# EAGLE design TSOC_Teensy3X (EAGLE 6.6.0)
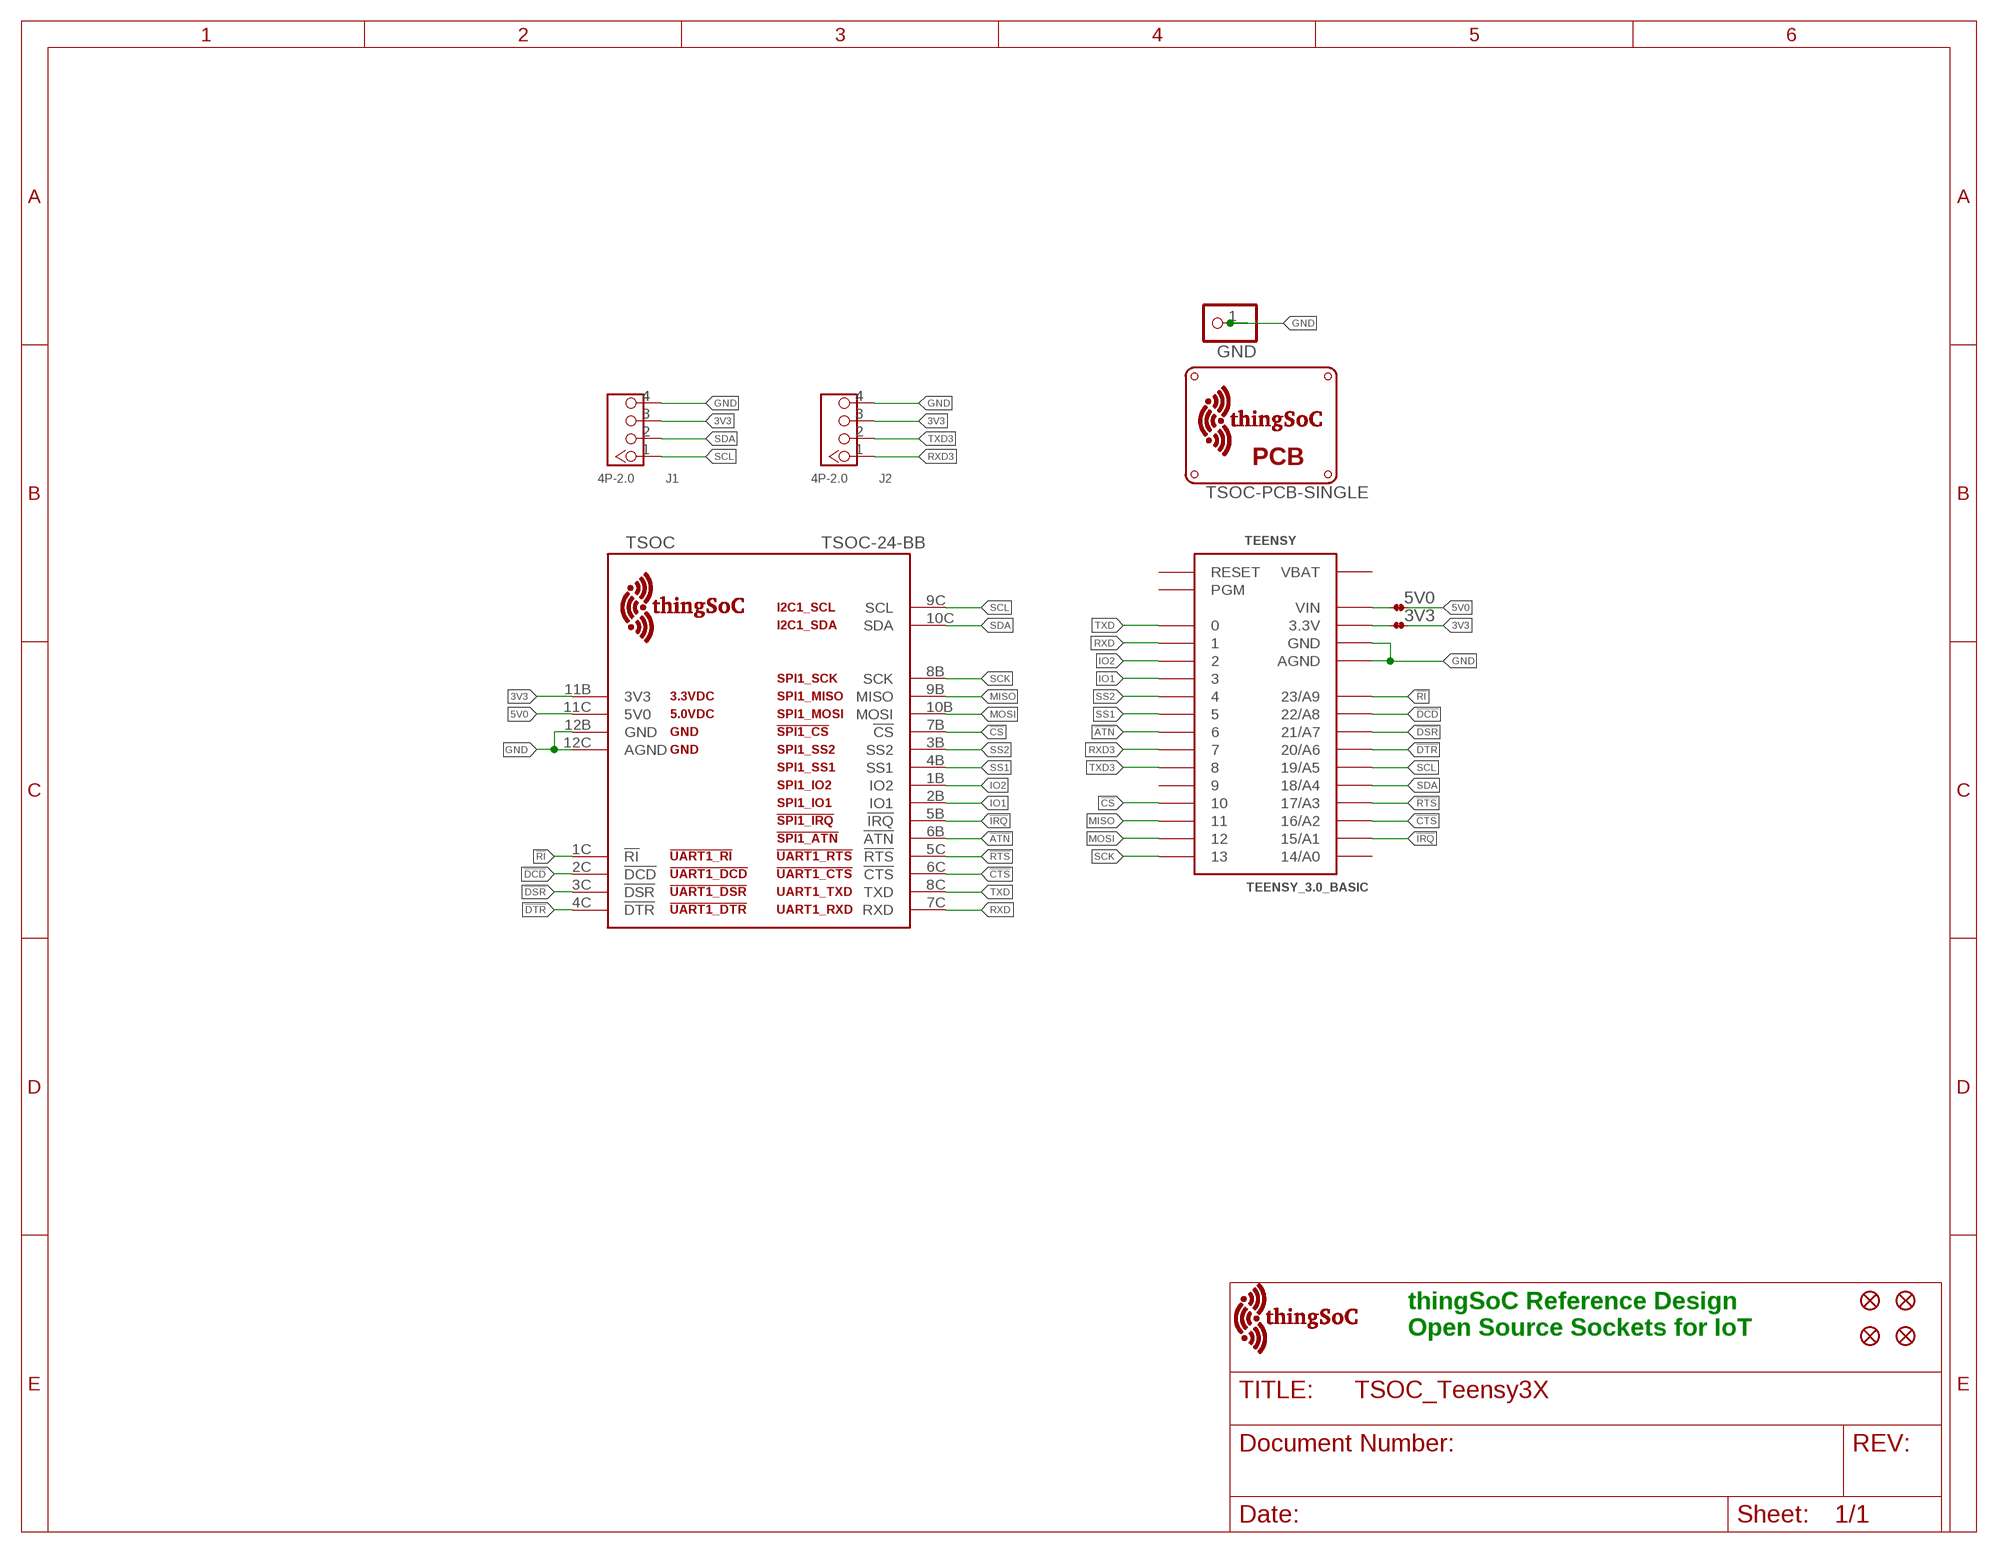
[diagram p0: schematic, sheet 1]

## Parts
3V3  JMP-2-NC  [JMP-2-NC]
5V0  JMP-2-NC  [JMP-2-NC]
FID1  FIDUCIALUFIDUCIAL  [MICRO-FIDUCIAL]
FID2  FIDUCIALUFIDUCIAL  [MICRO-FIDUCIAL]
FID3  FIDUCIALUFIDUCIAL  [MICRO-FIDUCIAL]
FID4  FIDUCIALUFIDUCIAL  [MICRO-FIDUCIAL]
GND  WPAD-1-PTH  [WPAD-1-PTH-2.54]
J1  4P-2.0  GROVE-CONNECTOR-DIP(4P-2.0)  [HW4-2.0]
J2  4P-2.0  GROVE-CONNECTOR-DIP(4P-2.0)  [HW4-2.0]
TEENSY  TEENSY_3.0_BASIC  [TEENSY_3.0_BASIC]
TSOC  TSOC-24-BB  [TSOC-BB-S24]
U$2  TSOC-PCB-SINGLE  [TSOC-BB-BRD-DIM]
U$5  TSOC-LOGO-LRG  [TSOC-LOGO-LRG]

## Nets
3V3: 3V3.2 J1.3 J2.3 TSOC.11B(3V3)
3V3I: 3V3.1 TEENSY.3.3V TEENSY.3.3V1(3.3V)
5V0: 5V0.2 TSOC.11C(5V0)
!ATN: TEENSY.6 TSOC.6B(!ATN)
!CS: TEENSY.10 TSOC.7B(!CS)
!CTS: TEENSY.16/A2 TSOC.6C(!CTS)
!DCD: TEENSY.22/A8 TSOC.2C(!DCD)
!DSR: TEENSY.21/A7 TSOC.3C(!DSR)
!DTR: TEENSY.20/A6 TSOC.4C(!DTR)
!IRQ: TEENSY.15/A1 TSOC.5B(!IRQ)
!RI: TEENSY.23/A9 TSOC.1C(!RI)
!RTS: TEENSY.17/A3 TSOC.5C(!RTS)
GND: GND.1 J1.4 J2.4 TEENSY.AGND TEENSY.GND TEENSY.GND1(GND) TSOC.12B(GND) TSOC.12C(AGND)
IO1: TEENSY.3 TSOC.2B(IO1)
IO2: TEENSY.2 TSOC.1B(IO2)
MISO: TEENSY.11 TSOC.9B(MISO)
MOSI: TEENSY.12 TSOC.10B(MOSI)
RXD: TEENSY.1 TSOC.7C(RXD)
RXD3: J2.1 TEENSY.7
SCK: TEENSY.13 TSOC.8B(SCK)
SCL: J1.1 TEENSY.19/A5 TSOC.9C(SCL)
SDA: J1.2 TEENSY.18/A4 TSOC.10C(SDA)
SS1: TEENSY.5 TSOC.4B(SS1)
SS2: TEENSY.4 TSOC.3B(SS2)
TXD: TEENSY.0 TSOC.8C(TXD)
TXD3: J2.2 TEENSY.8
VIN: 5V0.1 TEENSY.VIN
Unconnected: TEENSY.9 TEENSY.14/A0 TEENSY.PGM TEENSY.RESET

## Notes on the sheet
- thingSoC Reference Design
  Open Source Sockets for IoT

## Power pins joined to a net without a drawn wire
VBAT: TEENSY.VBAT

## Library data of the parts
3V3 5V0 = PatternAgents-ProtoPads:JMP-2-NC: Two Terminal Jumper - Normally Closed Positions 1 and 2 are normally connected. PatternAgents ProtoPads Library Schematic and PCB layout libraries for design patterns by PatternAgents. For the CADSoft Eagle CAD program : http://www.cadsoftusa.com/download-eagle/ Source LBR : http://www.patternagents.com Github : https://github.com/PatternAgents License : http://creativecommons.org/licenses/by-sa/4.0/ (Creative Commons 4.0) THIS SOFTWARE IS PROVIDED BY THE CONTRIBUTORS "AS IS" AND WITHOUT ANY EXPRESS OR IMPLIED WARRANTIES, INCLUDING, BUT NOT LIMITED TO, THE IMPLIED WARRANTIES OF MERCHANTABILITY AND FITNESS FOR A PARTICULAR PURPOSE ARE DISCLAIMED. IN NO EVENT SHALL THE COPYRIGHT OWNER OR CONTRIBUTORS BE LIABLE FOR ANY DIRECT, INDIRECT, INCIDENTAL, SPECIAL, EXEMPLARY, OR CONSEQUENTIAL DAMAGES (INCLUDING, BUT NOT LIMITED TO, PROCUREMENT OF SUBSTITUTE GOODS OR SERVICES; LOSS OF USE, DATA, OR PROFITS; OR BUSINESS INTERRUPTION) HOWEVER CAUSED AND ON ANY THEORY OF LIABILITY, WHETHER IN CONTRACT, STRICT LIABILITY, OR TORT (INCLUDING NEGLIGENCE OR OTHERWISE) ARISING IN ANY WAY OUT OF THE USE OF THIS SOFTWARE, EVEN IF ADVISED OF THE POSSIBILITY OF SUCH DAMAGE.; BOM: EXCLUDE
FID1-FID4 = TSOC-ESP8266-BASE:FIDUCIAL: Fiducial Alignment Points Various fiducial points for machine vision alignment.
GND = PatternAgents-ProtoPads:WPAD-1: Wire Pad - Single Good for scope lead clips, test jumpers, probe points, etc. PatternAgents ProtoPads Library Schematic and PCB layout libraries for design patterns by PatternAgents. For the CADSoft Eagle CAD program : http://www.cadsoftusa.com/download-eagle/ Source LBR : http://www.patternagents.com Github : https://github.com/PatternAgents License : http://creativecommons.org/licenses/by-sa/4.0/ (Creative Commons 4.0) THIS SOFTWARE IS PROVIDED BY THE CONTRIBUTORS "AS IS" AND WITHOUT ANY EXPRESS OR IMPLIED WARRANTIES, INCLUDING, BUT NOT LIMITED TO, THE IMPLIED WARRANTIES OF MERCHANTABILITY AND FITNESS FOR A PARTICULAR PURPOSE ARE DISCLAIMED. IN NO EVENT SHALL THE COPYRIGHT OWNER OR CONTRIBUTORS BE LIABLE FOR ANY DIRECT, INDIRECT, INCIDENTAL, SPECIAL, EXEMPLARY, OR CONSEQUENTIAL DAMAGES (INCLUDING, BUT NOT LIMITED TO, PROCUREMENT OF SUBSTITUTE GOODS OR SERVICES; LOSS OF USE, DATA, OR PROFITS; OR BUSINESS INTERRUPTION) HOWEVER CAUSED AND ON ANY THEORY OF LIABILITY, WHETHER IN CONTRACT, STRICT LIABILITY, OR TORT (INCLUDING NEGLIGENCE OR OTHERWISE) ARISING IN ANY WAY OUT OF THE USE OF THIS SOFTWARE, EVEN IF ADVISED OF THE POSSIBILITY OF SUCH DAMAGE.; BOM: EXCLUDE
J1 J2 = Seeed-Connector -2016:GROVE-CONNECTOR-DIP(4P-2.0): 320110033
TEENSY = Teensy3.0:TEENSY_3.0_BASIC: Basic Teensy 3.0 with none of the 'inner' pins enabled. See '+4', 'AllAnalogPins", and 'AllPins' packages for additional pin holes, as needed.
TSOC = thingSoC:TSOC-24: thingSoC Twenty-Four(24) Pin Socket Source LBR : http://www.thingsoc.com Github : https://github.com/thingsoc License : http://creativecommons.org/licenses/by-sa/4.0/ (Creative Commons 4.0) THIS SOFTWARE IS PROVIDED BY THE CONTRIBUTORS "AS IS" AND WITHOUT ANY EXPRESS OR IMPLIED WARRANTIES, INCLUDING, BUT NOT LIMITED TO, THE IMPLIED WARRANTIES OF MERCHANTABILITY AND FITNESS FOR A PARTICULAR PURPOSE ARE DISCLAIMED. IN NO EVENT SHALL THE COPYRIGHT OWNER OR CONTRIBUTORS BE LIABLE FOR ANY DIRECT, INDIRECT, INCIDENTAL, SPECIAL, EXEMPLARY, OR CONSEQUENTIAL DAMAGES (INCLUDING, BUT NOT LIMITED TO, PROCUREMENT OF SUBSTITUTE GOODS OR SERVICES; LOSS OF USE, DATA, OR PROFITS; OR BUSINESS INTERRUPTION) HOWEVER CAUSED AND ON ANY THEORY OF LIABILITY, WHETHER IN CONTRACT, STRICT LIABILITY, OR TORT (INCLUDING NEGLIGENCE OR OTHERWISE) ARISING IN ANY WAY OUT OF THE USE OF THIS SOFTWARE, EVEN IF ADVISED OF THE POSSIBILITY OF SUCH DAMAGE.
U$2 = thingSoC:TSOC-PCB: thingSoC PCB Outlines Boards Outlines for Standard Sizes (in the DImension Layer) (Registration marks in the tDocu layer - make sure to turn on tDocu/bDocu) Source LBR : http://www.thingsoc.com Github : https://github.com/thingsoc License : http://creativecommons.org/licenses/by-sa/4.0/ (Creative Commons 4.0) THIS SOFTWARE IS PROVIDED BY THE CONTRIBUTORS "AS IS" AND WITHOUT ANY EXPRESS OR IMPLIED WARRANTIES, INCLUDING, BUT NOT LIMITED TO, THE IMPLIED WARRANTIES OF MERCHANTABILITY AND FITNESS FOR A PARTICULAR PURPOSE ARE DISCLAIMED. IN NO EVENT SHALL THE COPYRIGHT OWNER OR CONTRIBUTORS BE LIABLE FOR ANY DIRECT, INDIRECT, INCIDENTAL, SPECIAL, EXEMPLARY, OR CONSEQUENTIAL DAMAGES (INCLUDING, BUT NOT LIMITED TO, PROCUREMENT OF SUBSTITUTE GOODS OR SERVICES; LOSS OF USE, DATA, OR PROFITS; OR BUSINESS INTERRUPTION) HOWEVER CAUSED AND ON ANY THEORY OF LIABILITY, WHETHER IN CONTRACT, STRICT LIABILITY, OR TORT (INCLUDING NEGLIGENCE OR OTHERWISE) ARISING IN ANY WAY OUT OF THE USE OF THIS SOFTWARE, EVEN IF ADVISED OF THE POSSIBILITY OF SUCH DAMAGE.
U$5 = thingSoC:TSOC-LOGO: thingSoC Logo Source LBR : http://www.thingsoc.com Github : https://github.com/thingsoc License : http://creativecommons.org/licenses/by-sa/4.0/ (Creative Commons 4.0) THIS SOFTWARE IS PROVIDED BY THE CONTRIBUTORS "AS IS" AND WITHOUT ANY EXPRESS OR IMPLIED WARRANTIES, INCLUDING, BUT NOT LIMITED TO, THE IMPLIED WARRANTIES OF MERCHANTABILITY AND FITNESS FOR A PARTICULAR PURPOSE ARE DISCLAIMED. IN NO EVENT SHALL THE COPYRIGHT OWNER OR CONTRIBUTORS BE LIABLE FOR ANY DIRECT, INDIRECT, INCIDENTAL, SPECIAL, EXEMPLARY, OR CONSEQUENTIAL DAMAGES (INCLUDING, BUT NOT LIMITED TO, PROCUREMENT OF SUBSTITUTE GOODS OR SERVICES; LOSS OF USE, DATA, OR PROFITS; OR BUSINESS INTERRUPTION) HOWEVER CAUSED AND ON ANY THEORY OF LIABILITY, WHETHER IN CONTRACT, STRICT LIABILITY, OR TORT (INCLUDING NEGLIGENCE OR OTHERWISE) ARISING IN ANY WAY OUT OF THE USE OF THIS SOFTWARE, EVEN IF ADVISED OF THE POSSIBILITY OF SUCH DAMAGE.

## Net classes
1 vcc: width 0.254 mm

## Board
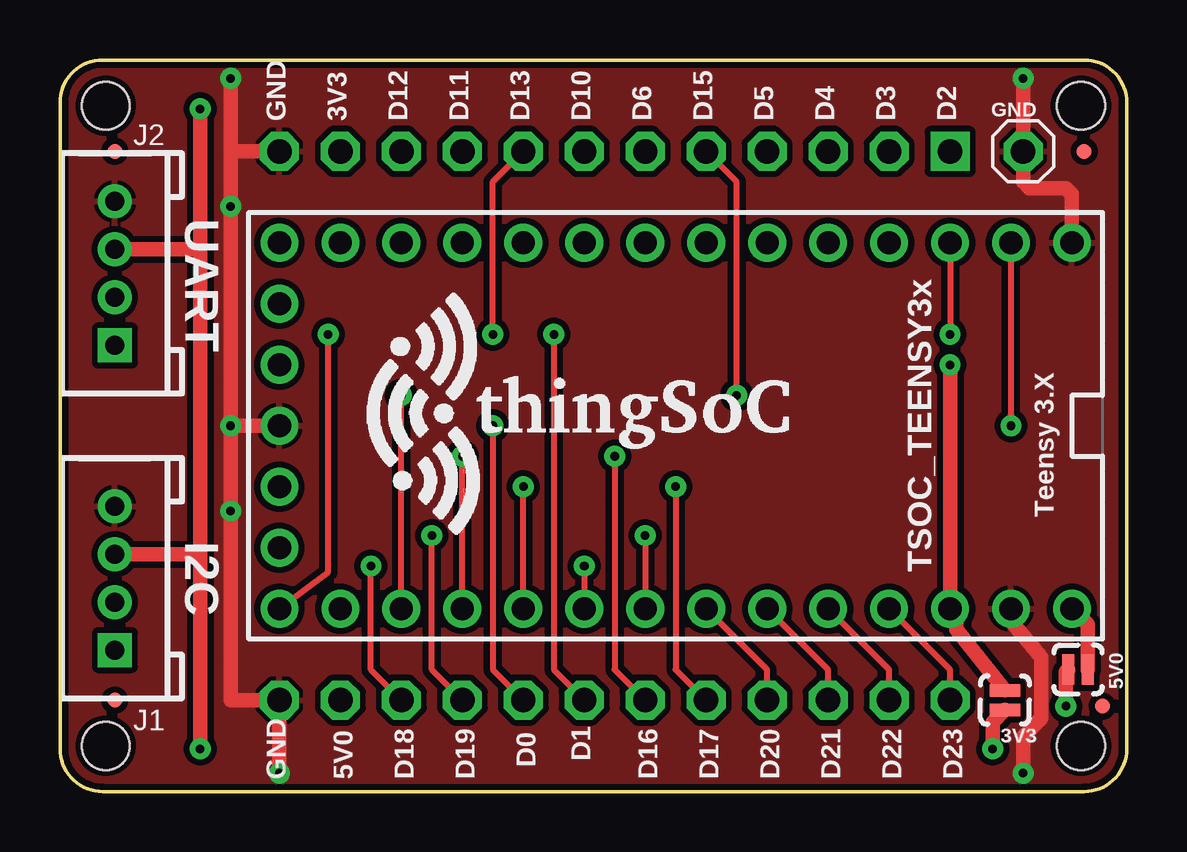
[diagram p1: board, top side]
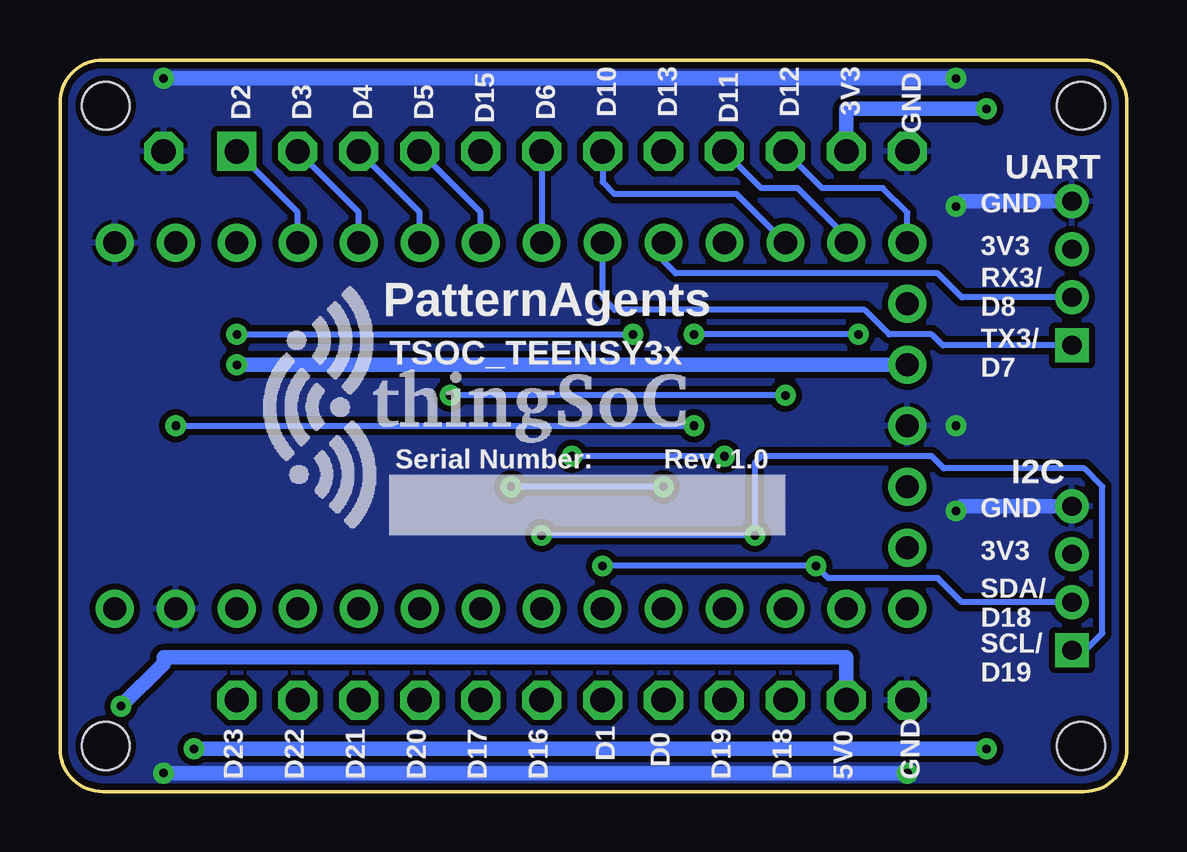
[diagram p2: board, bottom side, seen from below]

Size 44.45 x 30.48 mm. Coordinates in mm from the lower left corner, seen from the top.
Copper layers (1*16): Top 0.035mm / dielectric 1.5mm / Bottom 0.035mm
Design rules "PatternAgents_7mil": minimum track width 7mil, minimum drill 14mil, track to track 7mil, track to pad 7mil, pad to pad 7mil, via to via 7mil, smd to smd 7mil, copper to edge 7mil, drill to drill 7mil, minimum pad ring 12mil, minimum via ring 10mil, stop-mask expansion 4mil, vias tented up to drill 25mil, thermal gap 7mil

### Footprints (pad centres in the part's own frame; a part is rotated, then mirrored left to right if it is on the bottom)
JMP-2-NC = smd 0.508 x 1.27: 1 -0.401,0; 2 0.413,0
MICRO-FIDUCIAL = smd 0.635 x 0.635: 1 0,0
WPAD-1-PTH-2.54 = drill 1.016 octagon: 1 0,0
HW4-2.0 = drill 0.8 pad 1.27 square: 1 -3,0 | drill 0.8 pad 1.27: 2 -1,0; 3 1,0; 4 3,0
TEENSY_3.0_BASIC = drill 0.965: 0 -7.62,13.97; 1 -7.62,11.43; 2 -7.62,8.89; 3 -7.62,6.35; 3.3V 7.62,11.43; 3.3V1 -2.54,-16.51; 4 -7.62,3.81; 5 -7.62,1.27; 6 -7.62,-1.27; 7 -7.62,-3.81; 8 -7.62,-6.35; 9 -7.62,-8.89; 10 -7.62,-11.43; 11 -7.62,-13.97; 12 -7.62,-16.51; 13 7.62,-16.51; 14/A0 7.62,-13.97; 15/A1 7.62,-11.43; 16/A2 7.62,-8.89; 17/A3 7.62,-6.35; 18/A4 7.62,-3.81; 19/A5 7.62,-1.27; 20/A6 7.62,1.27; 21/A7 7.62,3.81; 22/A8 7.62,6.35; 23/A9 7.62,8.89; AGND 7.62,13.97; GND -7.62,16.51; GND1 0,-16.51; PGM 2.54,-16.51; RESET 5.08,-16.51; VBAT -5.08,-16.51; VIN 7.62,16.51
TSOC-BB-S24 = drill 1.016 square: 1B -11.43,11.43 | drill 1.016 octagon: 1C 11.43,11.43; 2B -11.43,8.89; 2C 11.43,8.89; 3B -11.43,6.35; 3C 11.43,6.35; 4B -11.43,3.81; 4C 11.43,3.81; 5B -11.43,1.27; 5C 11.43,1.27; 6B -11.43,-1.27; 6C 11.43,-1.27; 7B -11.43,-3.81; 7C 11.43,-3.81; 8B -11.43,-6.35; 8C 11.43,-6.35; 9B -11.43,-8.89; 9C 11.43,-8.89; 10B -11.43,-11.43; 10C 11.43,-11.43; 11B -11.43,-13.97; 11C 11.43,-13.97; 12B -11.43,-16.51; 12C 11.43,-16.51
TSOC-BB-BRD-DIM = hole 2: 13.335,16.891; -13.335,16.891; 13.335,-23.749; -13.335,-23.749

### Placement (x,y rotation side)
3V3  39.37,3.81 270 top
5V0  42.42,5.08 180 top
FID1  2.29,3.81 0 top
FID2  43.43,3.56 0 top
FID3  2.29,26.67 0 top
FID4  42.67,26.67 0 top
GND  40.13,26.67 0 top
J1  2.29,8.89 90 top
J2  2.29,21.59 90 top
TEENSY  25.65,15.24 270 top
TSOC  25.65,15.24 270 top
U$1  TSOC-LOGO-LRG  [TSOC-LOGO-LRG]  32.77,16 0 bottom
U$2  25.65,15.24 270 top
U$5  16,15.75 0 top

### Tracks (layer width: path | path; a pad name or v marks a point on that pad's centre or on a via)
3V3  (via drill 0.36)
  Top 0.61: v5.84,28.45 5.84,22.61 | 5.84,22.61 5.84,9.91 | 5.84,9.91 v5.84,1.78 | v38.86,1.78 38.86,2.89 3V3.2 | J1.3 5.83,9.89 5.84,9.91 | J2.3 5.83,22.59 5.84,22.61
  Bottom 0.61: TSOC.11B 11.68,28.45 v5.84,28.45 | v5.84,1.78 v38.86,1.78
3V3I  (via drill 0.36)
  Top 0.61: 3V3.1 37.34,6.75 37.34,7.37 TEENSY.3.3V v37.08,17.78
  Bottom 0.61: TEENSY.3.3V1 v37.08,17.78
5V0  (via drill 0.36)
  Top 0.61: v41.91,3.56 41.91,4.99 5V0.2
  Bottom 0.61: TSOC.11C 11.68,5.59 40.13,5.59 40.13,5.33 v41.91,3.56
!ATN
  Bottom 0.254: TSOC.6B TEENSY.6
!CS
  Bottom 0.254: TEENSY.10 16.26,24.89 21.34,24.89 21.84,25.4 TSOC.7B
!CTS  (via drill 0.36)
  Top 0.254: TEENSY.16/A2 v16.76,13.97 | v23.11,13.97 23.11,5.08 TSOC.6C
  Bottom 0.254: v16.76,13.97 v23.11,13.97
!DCD
  Top 0.254: TSOC.2C 34.54,5.08 TEENSY.22/A8
!DSR
  Top 0.254: TSOC.3C 32,5.08 TEENSY.21/A7
!DTR
  Top 0.254: TSOC.4C 29.46,5.08 TEENSY.20/A6
!IRQ  (via drill 0.36)
  Top 0.254: TEENSY.15/A1 v14.22,16.51 | v28.19,16.51 28.19,25.4 TSOC.5B
  Bottom 0.254: v14.22,16.51 v28.19,16.51
!RI
  Top 0.254: TSOC.1C 37.08,5.08 TEENSY.23/A9
!RTS  (via drill 0.36)
  Top 0.254: TSOC.5C 25.65,5.08 v25.65,12.7 | TEENSY.17/A3 v19.3,12.7
  Bottom 0.254: v19.3,12.7 v25.65,12.7
GND  (via drill 0.36)
  Top 0.61: TEENSY.GND1 v7.11,15.24 | TEENSY.AGND 39.62,7.11 40.89,5.59 40.89,3.05 40.13,2.29 v40.13,0.76 | v7.11,15.24 v7.11,11.68 7.11,3.81 TSOC.12C v9.14,0.76 | v7.11,29.72 7.11,26.67 | v7.11,15.24 v7.11,24.38 7.11,26.67 | TSOC.12B 7.11,26.67 | v40.13,29.72 GND.1 40.13,25.4 40.39,25.15 41.91,25.15 42.16,24.89 TEENSY.GND
  Bottom 0.61: v7.11,29.72 v40.13,29.72 | v40.13,0.76 v9.14,0.76 | J1.4 6.91,11.89 v7.11,11.68 | J2.4 6.91,24.59 v7.11,24.38
  pour Top (isolate 0.254, hatched): 1.02,0 0,1.27 0,29.21 1.02,30.48 43.18,30.48 44.45,29.21 44.45,1.52 42.93,0
  pour Bottom (isolate 0.254, hatched): 1.02,0 0,1.27 0,29.21 1.02,30.48 43.18,30.48 44.45,29.21 44.45,1.52 42.93,0
IO1
  Bottom 0.254: TEENSY.3 32,24.13 TSOC.2B
IO2
  Bottom 0.254: TEENSY.2 34.54,24.13 TSOC.1B
MISO
  Bottom 0.254: TEENSY.11 11.68,23.11 13.72,25.15 15.24,25.15 TSOC.9B
MOSI
  Bottom 0.254: TEENSY.12 9.14,24.13 10.16,25.15 12.7,25.15 TSOC.10B
RXD  (via drill 0.36)
  Top 0.254: TEENSY.1 v37.08,19.05 | v20.57,19.05 20.57,5.08 TSOC.7C
  Bottom 0.254: v37.08,19.05 v20.57,19.05
RXD3
  Bottom 0.254: J2.1 7.67,18.59 8.13,19.05 9.91,19.05 10.92,20.07 21.34,20.07 21.84,20.57 TEENSY.7
SCK  (via drill 0.36)
  Top 0.254: v18.03,19.05 18.03,25.4 TSOC.8B | TEENSY.13 11.18,9.14 v11.18,19.05
  Bottom 0.254: v11.18,19.05 v18.03,19.05
SCL  (via drill 0.36)
  Top 0.254: TSOC.9C 15.49,5.08 v15.49,10.67 | v24.38,10.67 TEENSY.19/A5
  Bottom 0.254: v24.38,10.67 v15.49,10.67 15.49,13.72 15.24,13.97 8.13,13.97 7.62,13.46 1.78,13.46 1.02,12.7 1.02,6.6 1.73,5.89 J1.1
SDA  (via drill 0.36)
  Top 0.254: TSOC.10C 12.95,5.08 v12.95,9.4 | v21.84,9.4 TEENSY.18/A4
  Bottom 0.254: v21.84,9.4 v12.95,9.4 12.45,8.89 7.87,8.89 6.87,7.89 J1.2
SS1
  Bottom 0.254: TEENSY.5 26.92,24.13 TSOC.4B
SS2
  Bottom 0.254: TEENSY.4 29.46,24.13 TSOC.3B
TXD  (via drill 0.36)
  Top 0.254: TEENSY.0 v39.62,15.24 | v18.03,15.24 18.03,5.08 TSOC.8C
  Bottom 0.254: v39.62,15.24 v18.03,15.24
TXD3
  Bottom 0.254: J2.2 6.87,20.59 7.87,21.59 18.8,21.59 19.3,22.1 TEENSY.8
VIN
  Top 0.61: 5V0.1 42.82,6.96 TEENSY.VIN

### Text on the board
tPlace: GND | 3V3 | D12 | D11 | D13 | D10 | D6 | D15 | D5 | D4 | D3 | D2 | UART | Teensy 3.X | I2C | TSOC_TEENSY3x | GND | 5V0 | D18 | D19 | D0 | D1 | D16 | D17 | D20 | D21 | D22 | D23
bPlace: GND | 3V3 | D12 | D11 | D13 | D10 | D15 | D6 | D5 | D4 | D3 | D2 | UART | GND | 3V3 | RX3/ / D8 | PatternAgents | TSOC_TEENSY3x | TX3/ / D7 | I2C | Rev. 1.0 | Serial Number: | GND | 3V3 | SDA/ / D18 | SCL/ / D19 | GND | 5V0 | D18 | D19 | D0 | D1 | D16 | D17 | D20 | D21 | D22 | D23